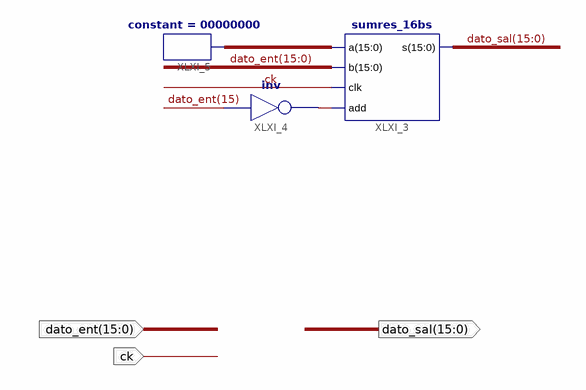
[diagram p0: schematic sheet 1]
// Xilinx ISE schematic complemento_a_dos.sch (spartan6) as structural Verilog: 3 symbols, 3 ports
module complemento_a_dos (
  input  [15:0] dato_ent,
  input  ck,
  output [15:0] dato_sal
);

  wire XLXN_9;
  wire [15:0] XLXN_6;

  sumres_16bs XLXI_3 (.b(dato_ent), .a(XLXN_6), .s(dato_sal), .clk(ck), .add(XLXN_9));
  not XLXI_4 (XLXN_9, dato_ent[15]);
  constant #(.CValue("00000000")) XLXI_5 (.O(XLXN_6));
endmodule
